# EasyEDA Pro project ProProject_Sheet1_2025-12-18.epro

# Schematic Sheet1
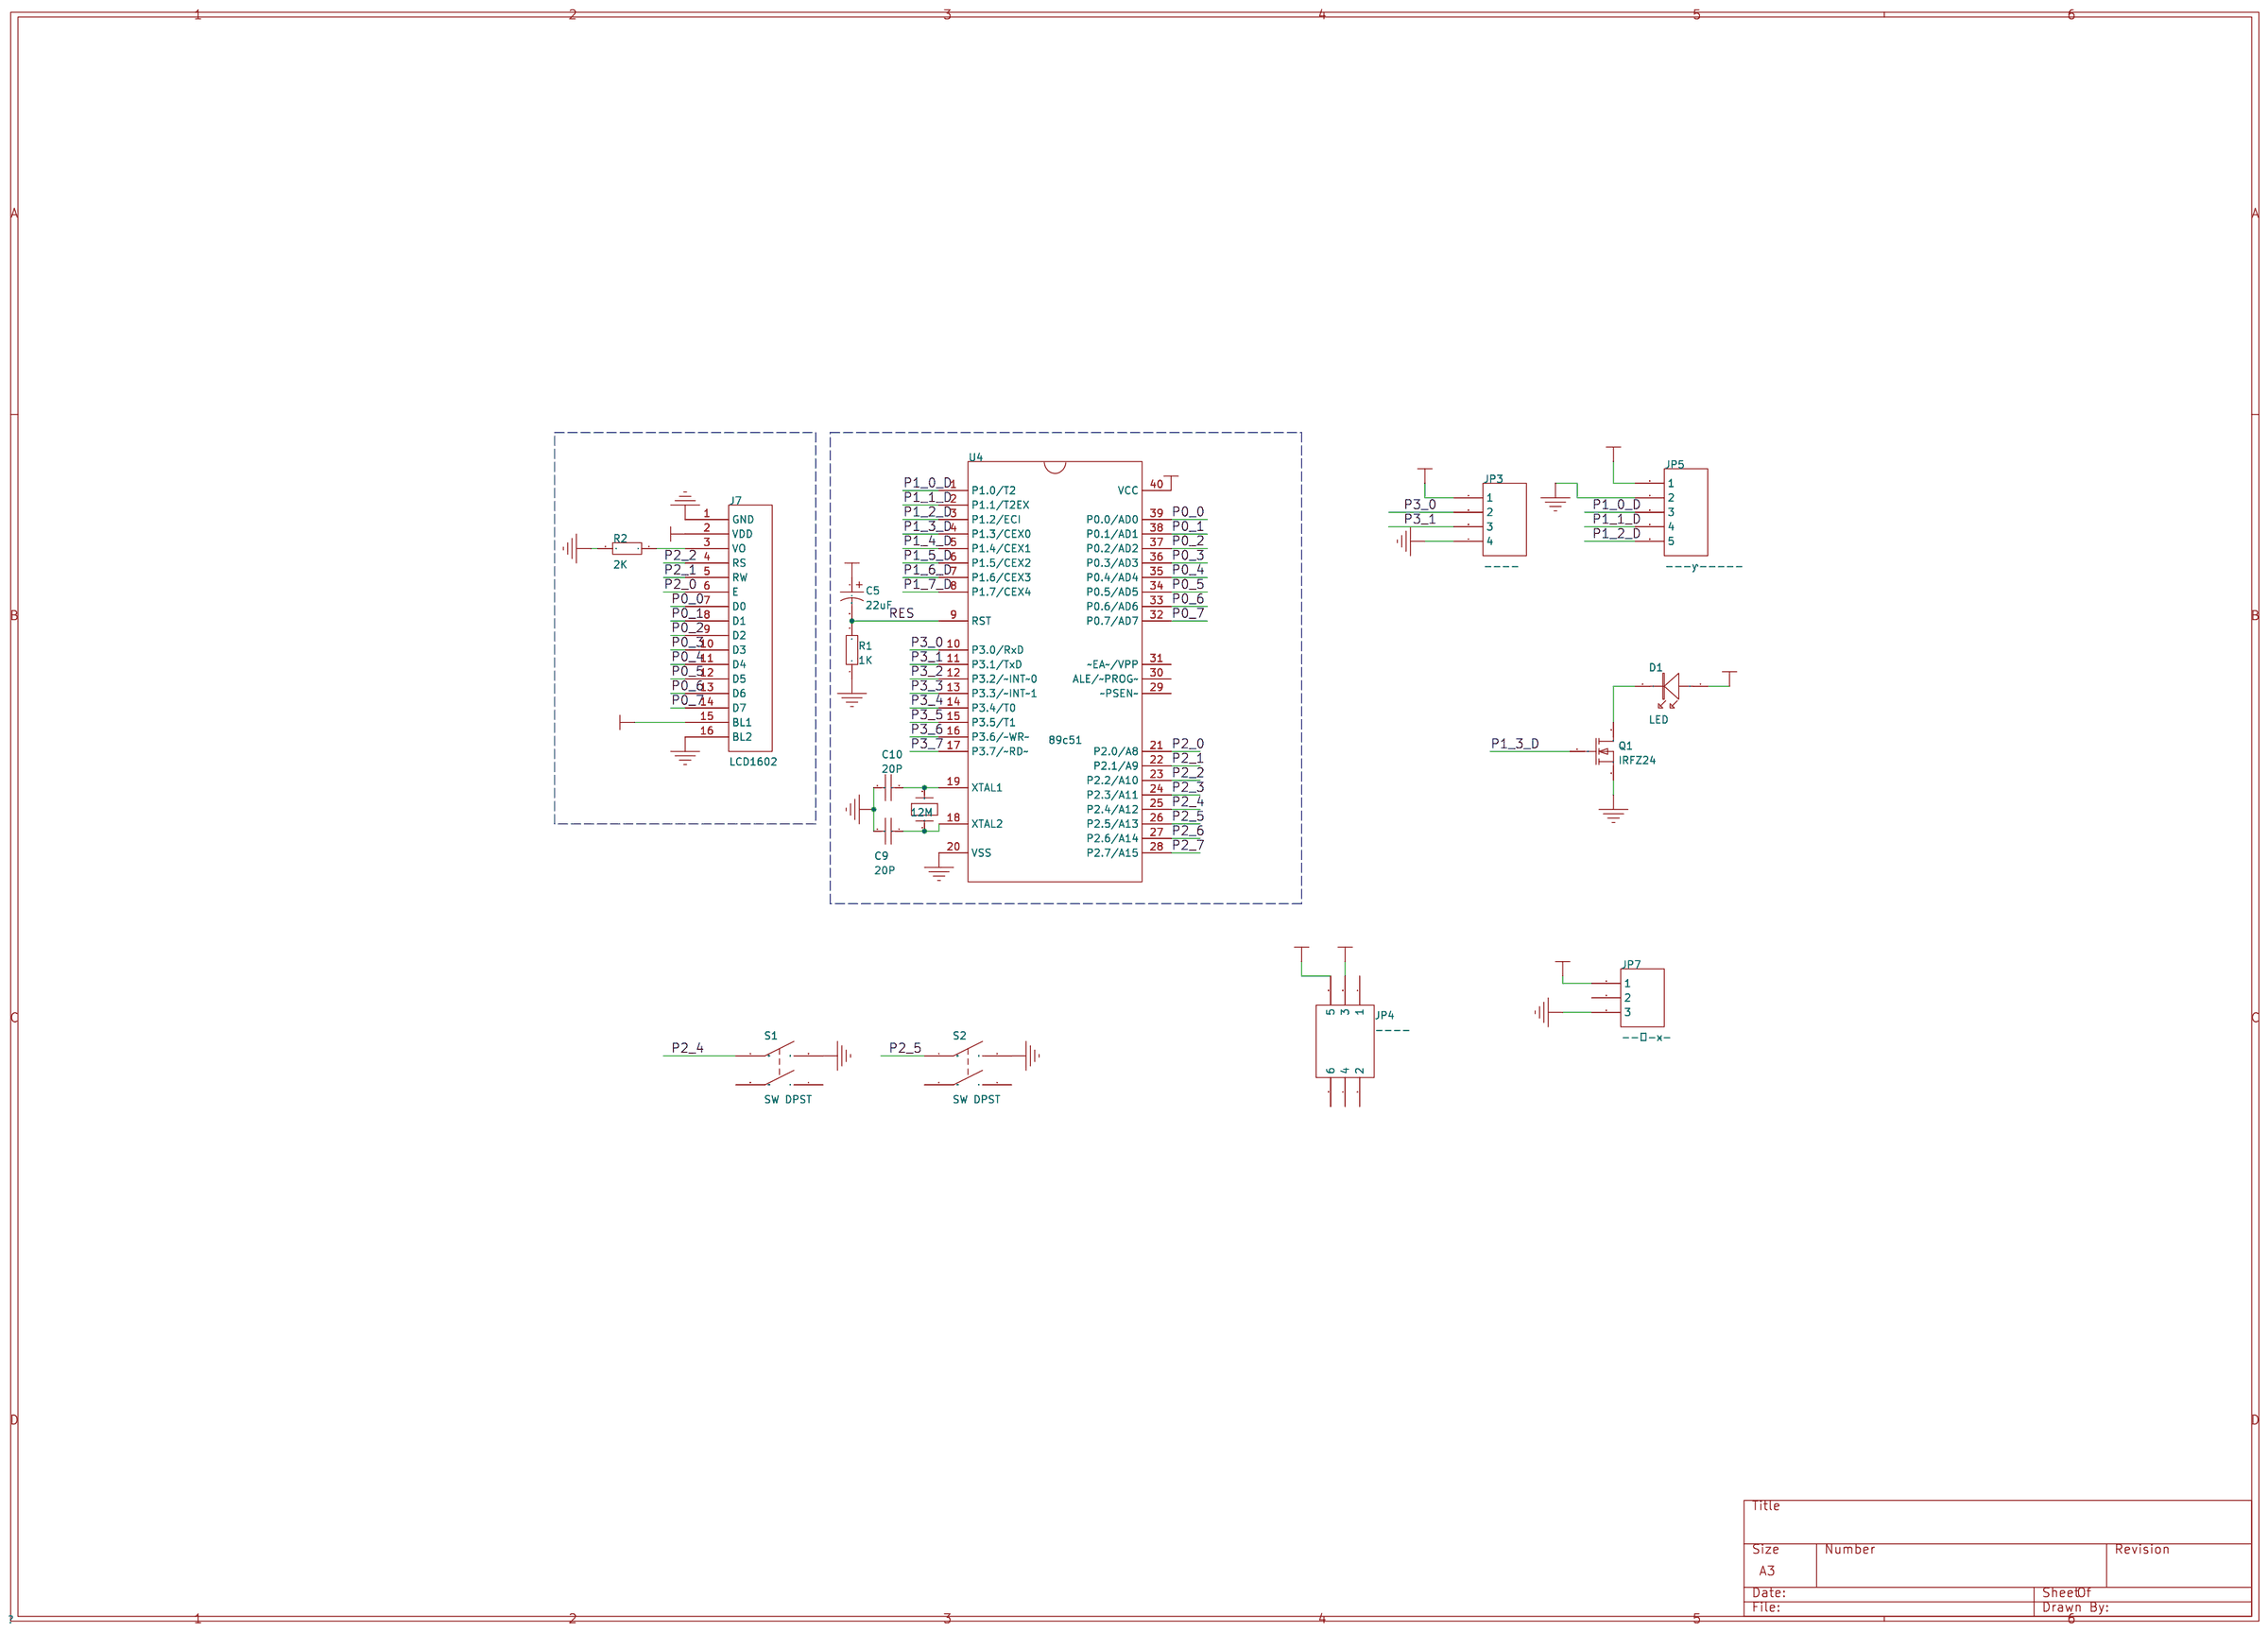
[diagram p0: schematic sheet]

## Parts
C5  22uF
C9  20P
C10  20P
D1  LED
J7  LCD1602
JP3  ----
JP4  ----
JP5  ---ƴ-----
JP7  --Դ-ӿ-
Q1  IRFZ24
R1  1K
R2  2K
S1  SW DPST
S2  SW DPST
U4  89c51
Y4  12M

## Library data of the parts
C5 = Cap Pol1: Polarized Capacitor (Radial); Published: 8-Jun-2000; LatestRevisionDate: 17-Jul-2002; LatestRevisionNote: Re-released for DXP Platform.; Publisher: Altium Limited; Origin Footprint 2: CAPPR1.27-1.7x2.8; Origin Footprint 3: CAPPR1.5-4x5; Origin Footprint 4: CAPPR2-5x6.8; Origin Footprint 5: CAPPR5-5x5; Origin Footprint 6: CAPPR7.5-16x35; Origin Footprint 1: CAP-0.2; Library Name: Miscellaneous Devices
C9 C10 = 20P: Capacitor; Origin Footprint 2: CAP-P; Origin Footprint 1: CAP-DIP; Design Item ID: CAP; Library Name: *
D1 = LED: Origin Footprint 2: DIODE0.1; Origin Footprint 1: CAP-DIP; Library Name: DIODE
J7 = LCD1602: Origin Footprint 2: HDR1X16; Library Name: *
JP3 = ����: 4 Pin Header; Design Item ID: 4 HEADER; Library Name: ---
JP4 = ����: Origin Footprint 2: IDC6; Origin Footprint 1: SW3; Design Item ID: HEADER 3X2; Library Name: -ӿ-
JP5 = ���ƴ�����: Design Item ID: HEADER 5; Library Name: --Ԫ----
JP7 = ��Դ�ӿ�: Origin Footprint 2: dip3; Origin Footprint 1: DC05; Design Item ID: HEADER 3; Library Name: --Ԫ----
Q1 = IRFZ24: N-Channel MOSFET; Library Name: --ЧӦ--
R1 R2 = Res2: Resistor; Published: 8-Jun-2000; LatestRevisionDate: 17-Jul-2002; LatestRevisionNote: Re-released for DXP Platform.; Publisher: Altium Limited; Library Name: Miscellaneous Devices
S1 S2 = SW DPST: Library Name: ----
U4 = 89c51: Origin Footprint 2: dip--40; Origin Footprint 1: dip--40; Library Name: ----Ԫ--
Y4 = 12M: Crystal; Origin Footprint 2: XY-0.3; Origin Footprint 1: XTAL; Design Item ID: CRYSTAL; Library Name: *

## Nets
GND: C9.2 C10.1 J7.1(GND) J7.16(BL2) JP3.4 JP5.2 JP7.3 Q1.3(S) R1.1 R2.2 S1.2(NO1) S2.2(NO1) U4.20(VSS)
VCC: C5.1 D1.1 J7.2(VDD) J7.15(BL1) JP3.1 JP4.3 JP5.1 U4.40(VCC)
VIN: JP4.5 JP7.1
P0_0: J7.7(D0) U4.39(P0.0/AD0)
P0_1: J7.8(D1) U4.38(P0.1/AD1)
P0_2: J7.9(D2) U4.37(P0.2/AD2)
P0_3: J7.10(D3) U4.36(P0.3/AD3)
P0_4: J7.11(D4) U4.35(P0.4/AD4)
P0_5: J7.12(D5) U4.34(P0.5/AD5)
P0_6: J7.13(D6) U4.33(P0.6/AD6)
P0_7: J7.14(D7) U4.32(P0.7/AD7)
P1_0_D: JP5.3 U4.1(P1.0/T2)
P1_1_D: JP5.4 U4.2(P1.1/T2EX)
P1_2_D: JP5.5 U4.3(P1.2/ECI)
P1_3_D: Q1.1(G) U4.4(P1.3/CEX0)
P1_4_D: U4.5(P1.4/CEX1)
P1_5_D: U4.6(P1.5/CEX2)
P1_6_D: U4.7(P1.6/CEX3)
P1_7_D: U4.8(P1.7/CEX4)
P2_0: J7.6(E) U4.21(P2.0/A8)
P2_1: J7.5(RW) U4.22(P2.1/A9)
P2_2: J7.4(RS) U4.23(P2.2/A10)
P2_3: U4.24(P2.3/A11)
P2_4: S1.1(COMMON1) U4.25(P2.4/A12)
P2_5: S2.1(COMMON1) U4.26(P2.5/A13)
P2_6: U4.27(P2.6/A14)
P2_7: U4.28(P2.7/A15)
P3_0: JP3.2 U4.10(P3.0/RxD)
P3_1: JP3.3 U4.11(P3.1/TxD)
P3_2: U4.12(P3.2/~INT~0)
P3_3: U4.13(P3.3/~INT~1)
P3_4: U4.14(P3.4/T0)
P3_5: U4.15(P3.5/T1)
P3_6: U4.16(P3.6/~WR~)
P3_7: U4.17(P3.7/~RD~)
RES: C5.2 R1.2 U4.9(RST)
Net-(C9-1): C9.1 U4.18(XTAL2) Y4.1
Net-(C10-2): C10.2 U4.19(XTAL1) Y4.2
Net-(D1-2): D1.2 Q1.2(D)
Net-(J7-3): J7.3(VO) R2.1

Not connected (* = marked no-connect by the designer): JP4 1 2 4 6; JP7 2; S1 3(COMMON2) 4(NO2); S2 3(COMMON2) 4(NO2); U4 29(~PSEN~) 30(ALE/~PROG~) 31(~EA~/VPP)

# Board PCB1_1
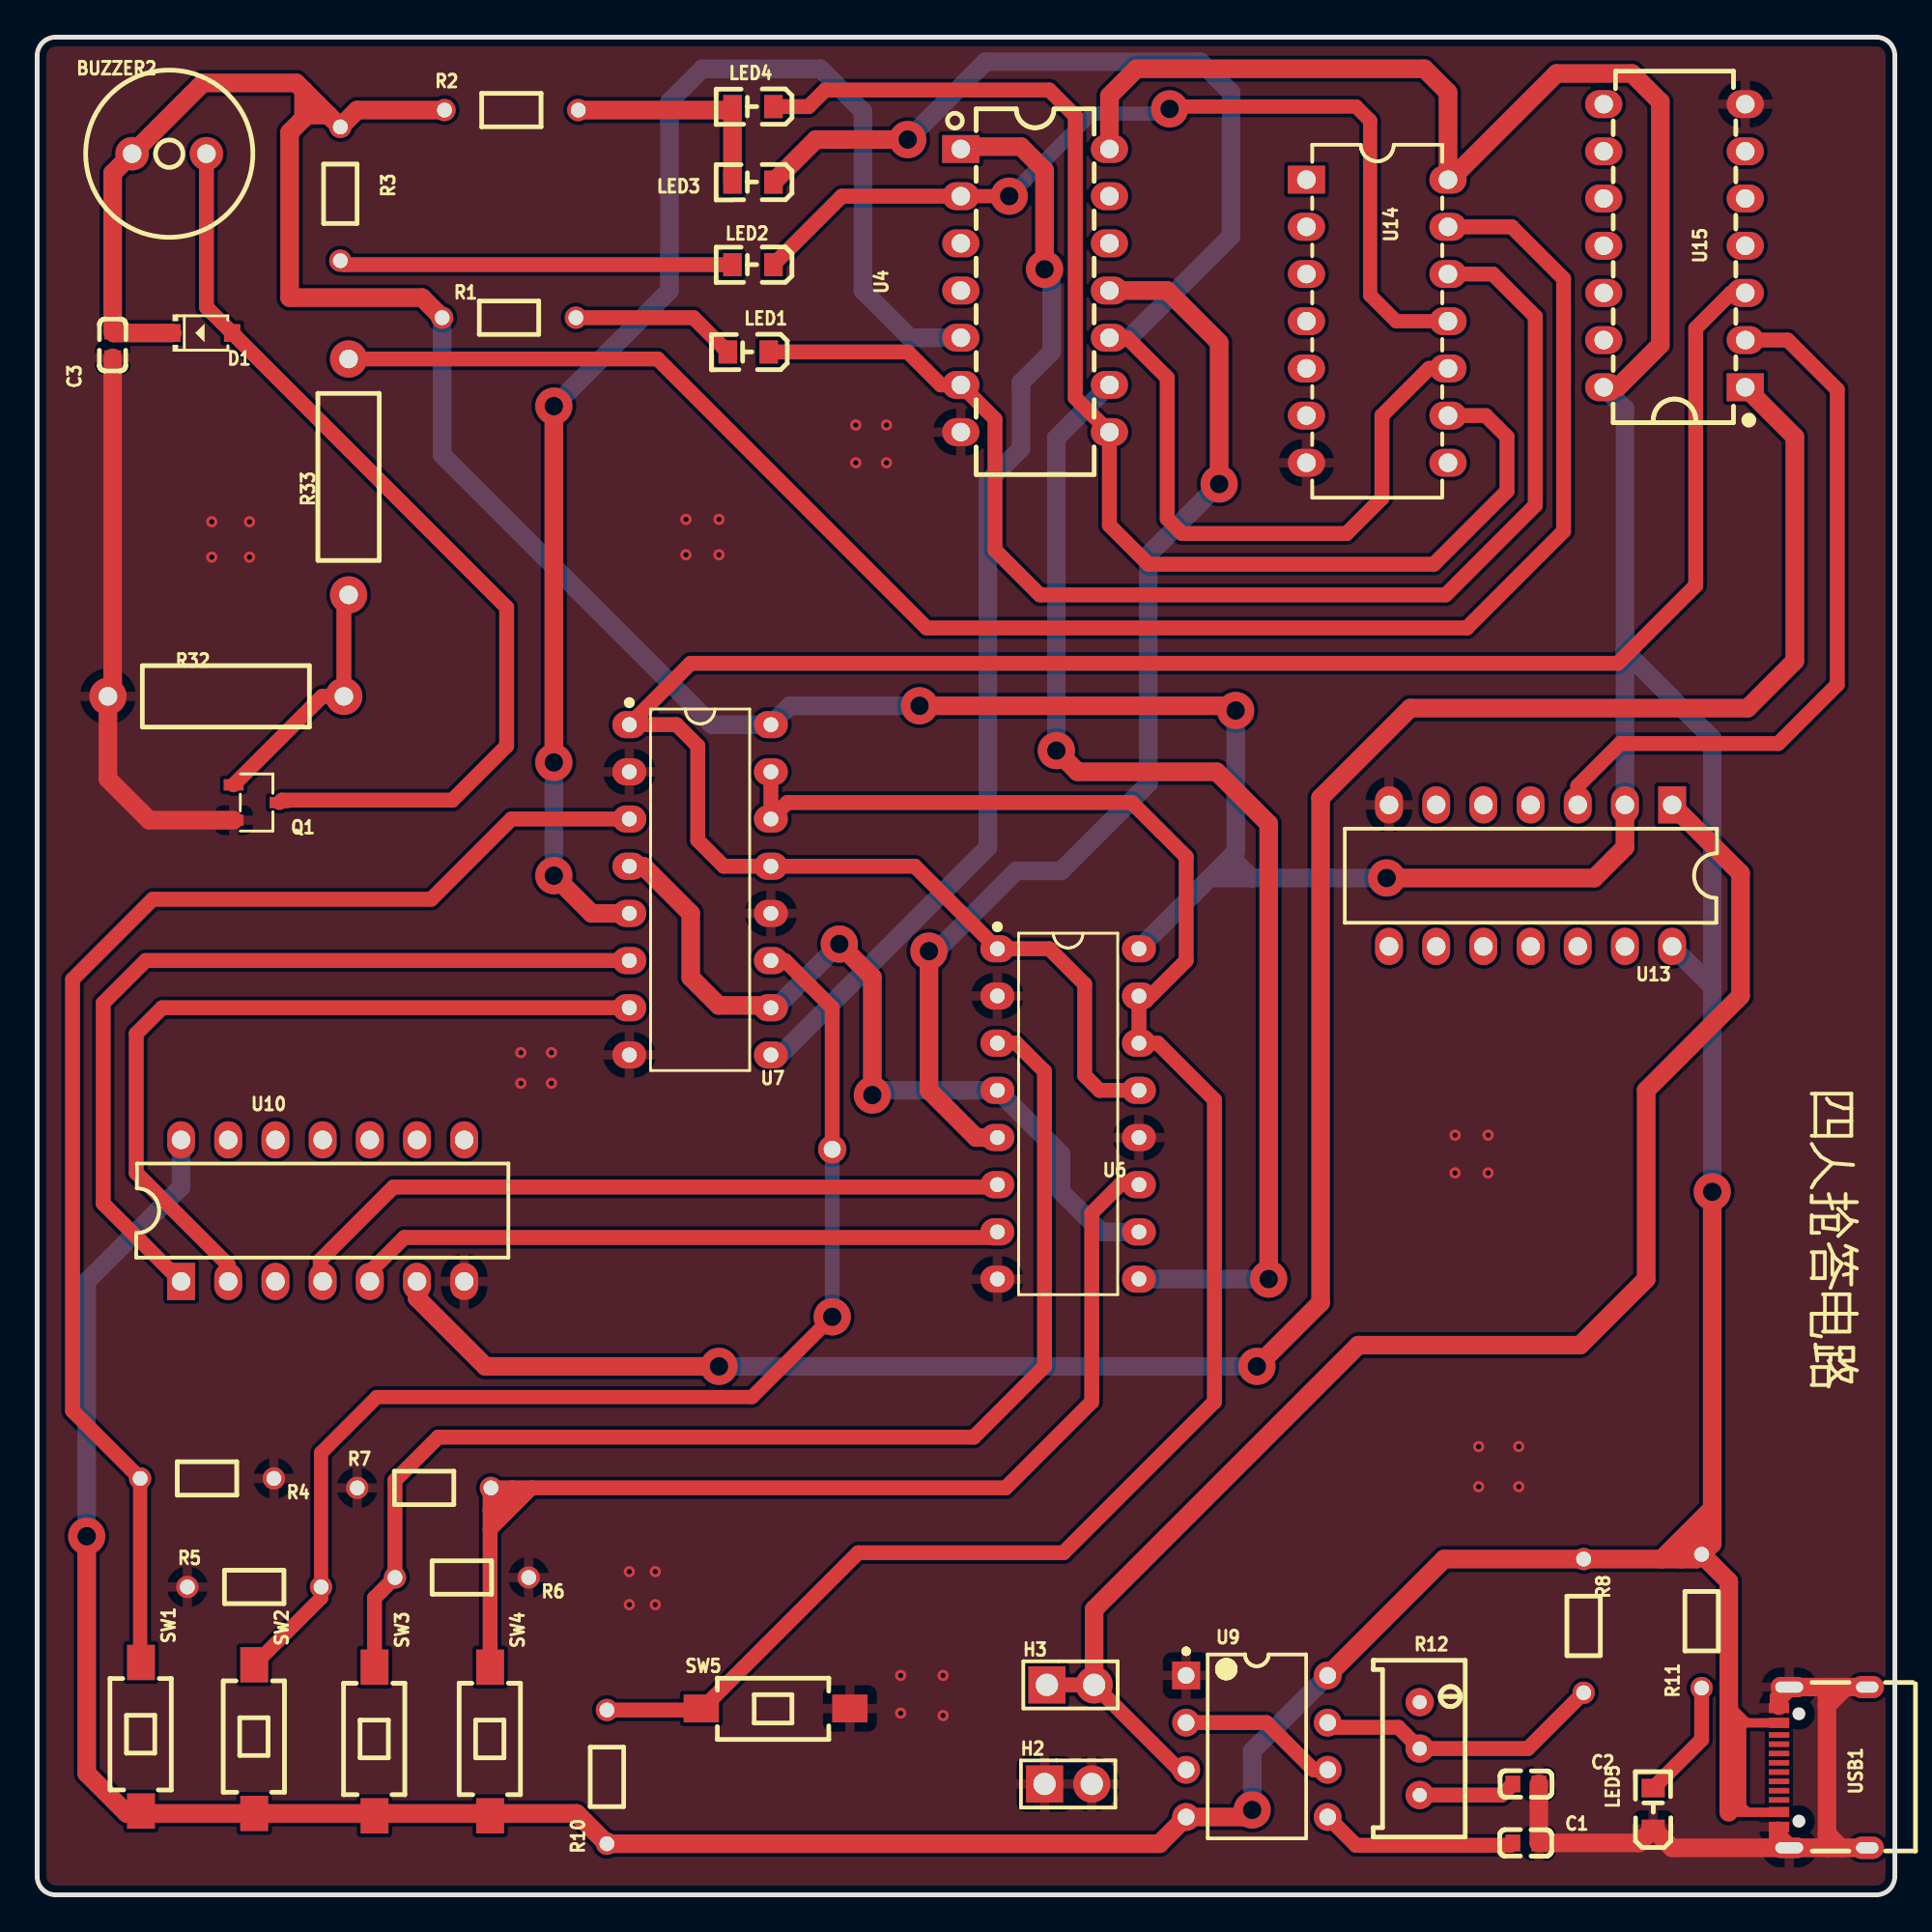
[diagram p1: board, top side]
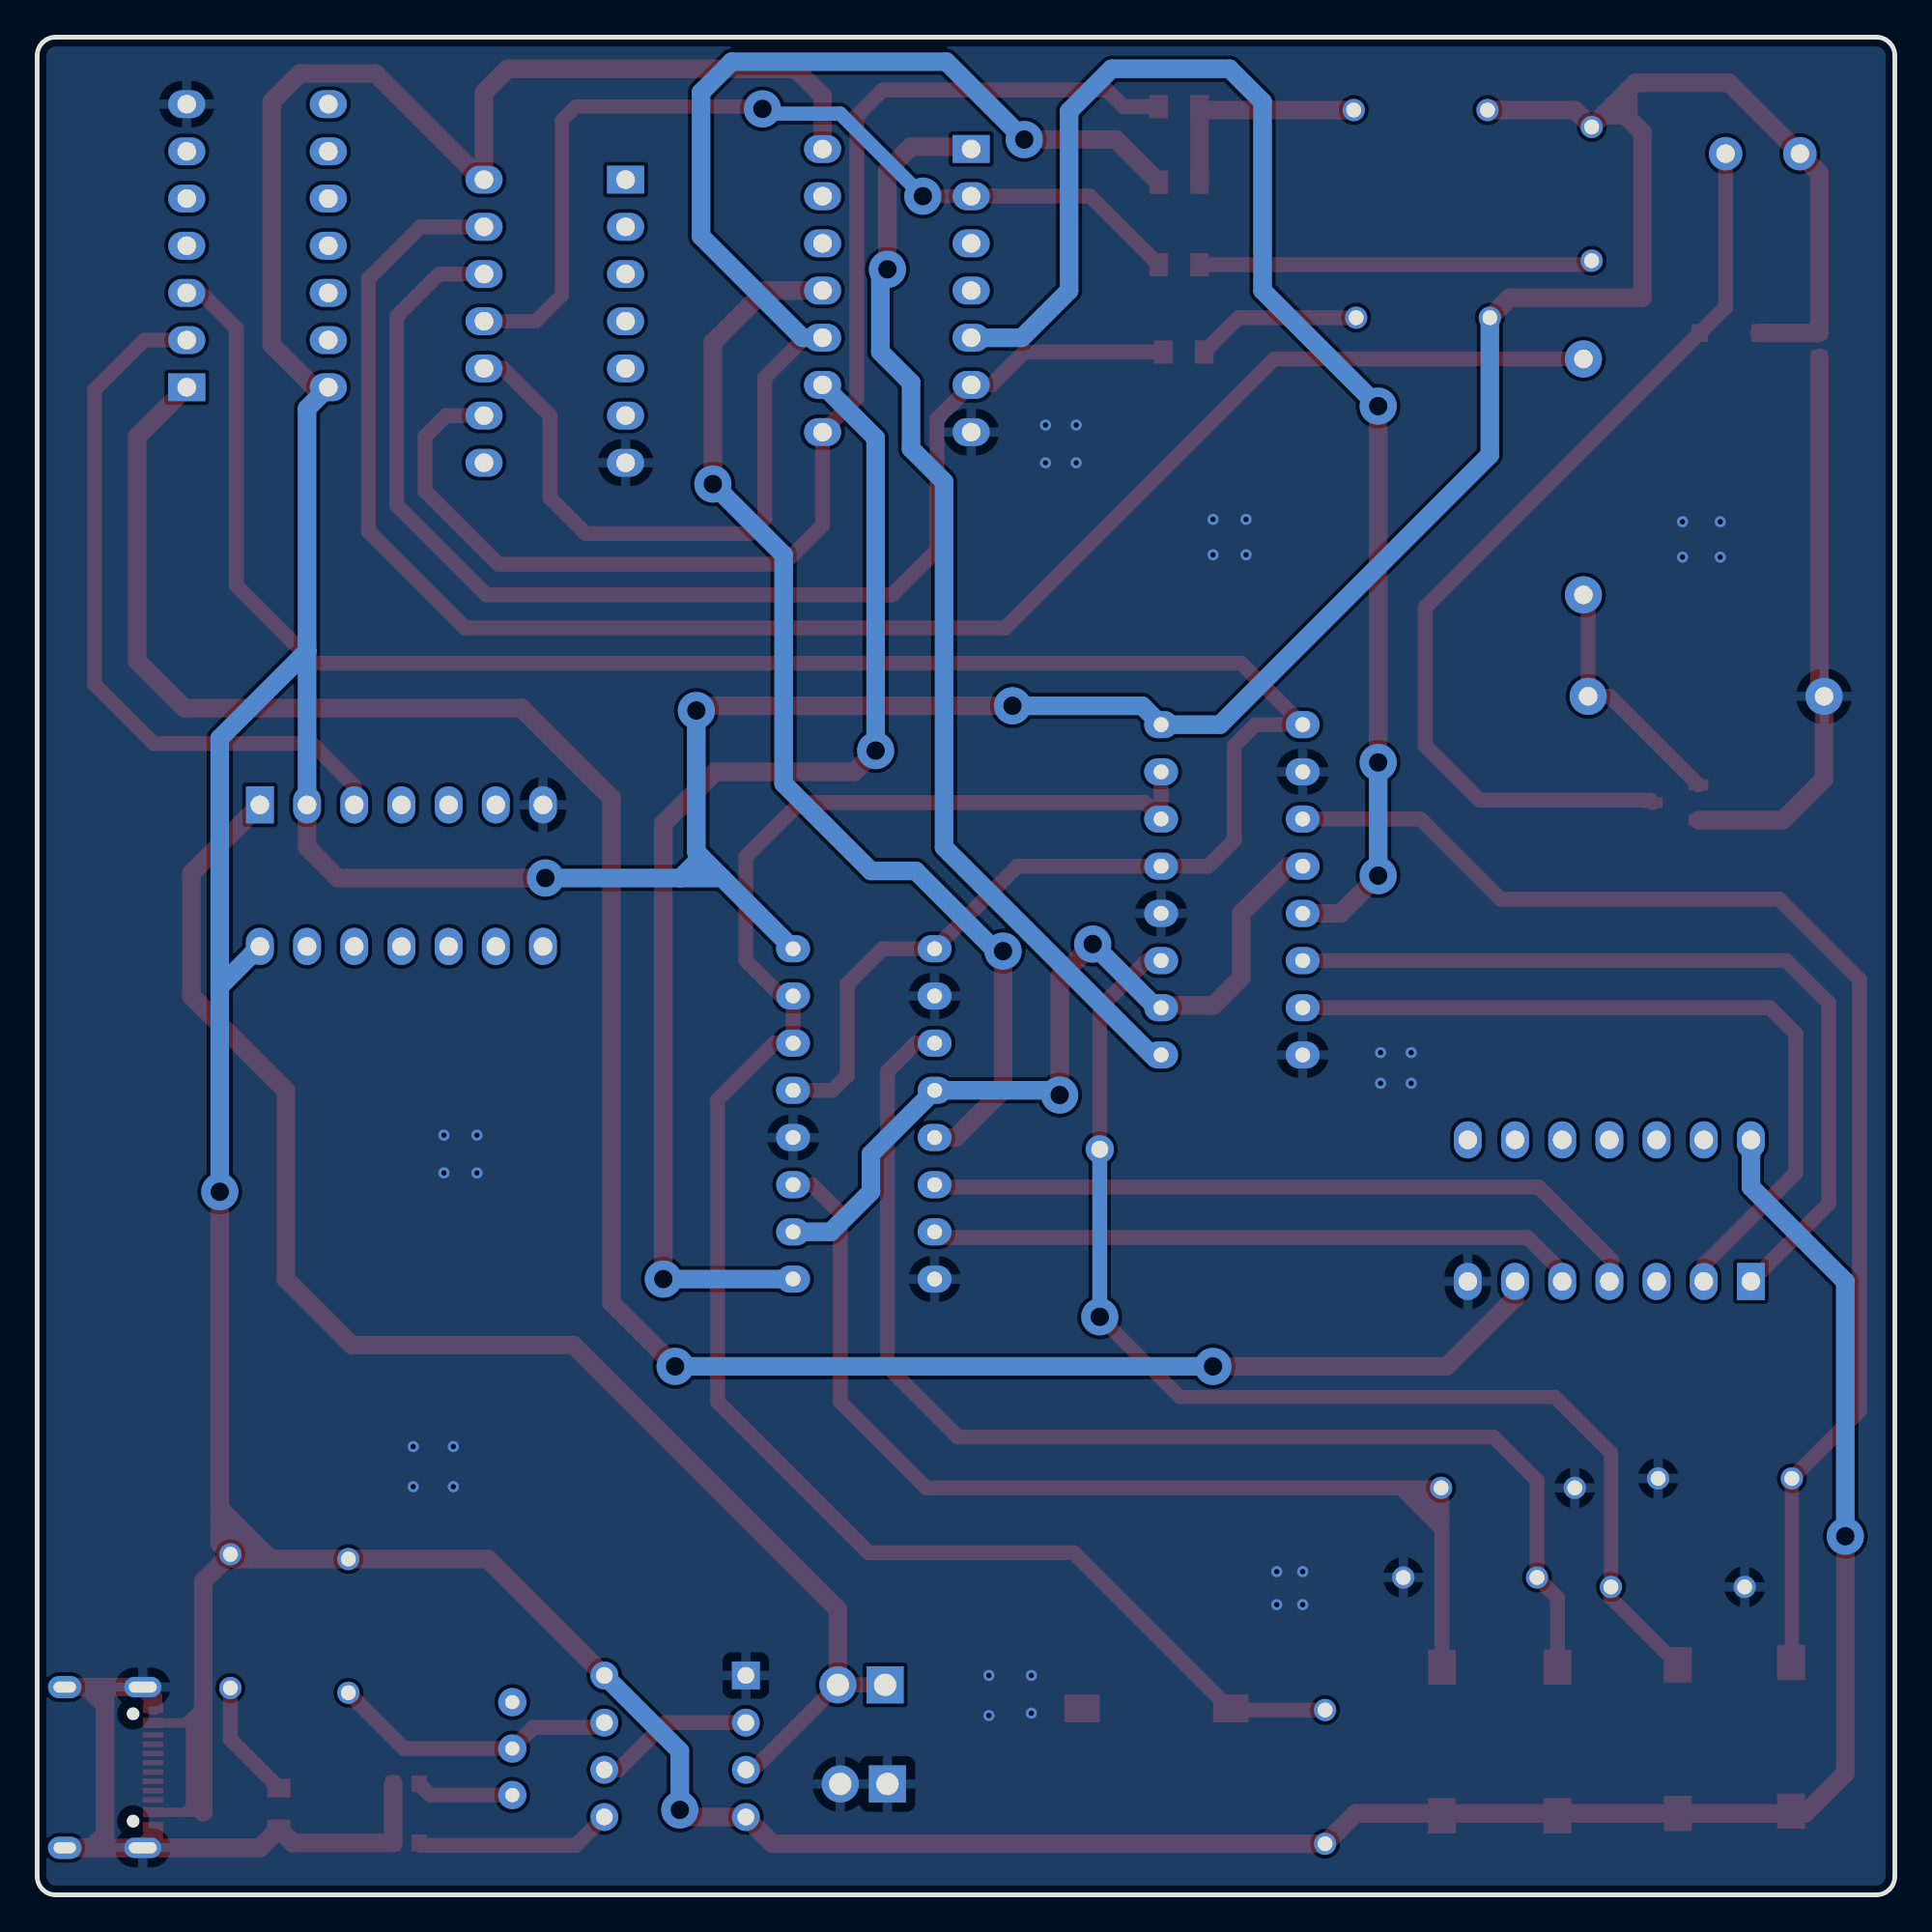
[diagram p2: board, bottom side, seen from below]

Outline 100 x 100 mm; copper layers: Top Layer, Bottom Layer. Coordinates in mm from the lower left corner of the outline.
Outline path: 0,99 0,1 arc(0.29,0.29) 1,0 99,0 arc(99.71,0.29) 100,1 100,99 arc(99.71,99.71) 99,100 1,100 arc(0.29,99.71) 0,99
Stack: Top Layer 0.035mm / Dielectric1 1.51mm FR4 er 4.5 / Bottom Layer 0.035mm

## Design rules (mm)
template: JLCPCB Capability(Two Layers Board)
spacing copperThickness1oz (default): track to track 0.102, other pairs 0.152 to 0.3
spacing copperThickness2oz: track to track 0.203, other pairs 0.152 to 0.3
track width copperThickness1oz (default): min 0.127, default 0.254, max 2.54
track width copperThickness2oz: min 0.203, default 0.254, max 2.54
differential pair differentialPair (default): width min 0.127, default 0.254, max 2.54; gap min 0.152, default 0.152
via viaSize (default): diameter min 0.5, default 0.61, max 10; hole min 0.3, default 0.305, max 6.3

## Placement (name value [footprint] x y rotation side)
BUZZER2  2.7kHz  [BUZ-TH_BD9.0-P4.00-D0.6-FD]  7.11 93.73 0 top
C1  0.1uf  [C0603]  80.14 2.79 0 top
C2  0.01uf  [C0603]  80.14 5.97 180 top
C3  0.1uF  [C0603]  4.06 83.44 90 top
D1  1N4148W  [SOD-123_L2.7-W1.6-LS3.7-FD]  8.89 84.07 180 top
H2  PZ254V-11-02P  [HDR-TH_2P-P2.54-V-M]  55.5 5.97 0 top
H3  PZ254V-11-02P  [HDR-TH_2P-P2.54-V-M]  55.63 11.3 0 top
LED1  -  [LED_0805]  38.23 83.06 180 top
LED2  -  [LED_0805]  38.48 87.76 180 top
LED3  -  [LED_0805]  38.48 92.2 180 top
LED4  -  [LED_0805]  38.48 96.27 180 top
LED5  -  [LED_0805]  87 4.7 90 top
NOREF  -  [Pad_e84]  42.8 40.13 0 top
Q1  S8050  [SOT-23-3_L2.9-W1.6-P1.90-LS2.8-BR]  11.81 58.8 180 top
R1  450Ω  [Res_1/8W]  25.4 84.84 0 top
R2  450  [Res_1/8W]  25.53 96.01 0 top
R3  450  [Res_1/8W]  16.38 91.57 90 top
R4  330  [Res_1/8W]  9.14 22.48 180 top
R5  330  [Res_1/8W]  11.68 16.51 0 top
R6  330  [Res_1/8W]  22.86 17.15 180 top
R7  330  [Res_1/8W]  20.83 21.84 0 top
R8  360  [Res_1/8W]  83.19 14.48 270 top
R10  47kΩ  [Res_1/8W]  30.73 6.35 90 top
R11  1K  [Res_1/8W]  89.66 14.73 90 top
R12  1kΩ（720）  [RES-ADJ-TH_3P-L10.0-W10.0-P2.50-BL-BS]  74.42 7.87 0 top
R32  10kΩ  [R_AXIAL-0.5/2W]  10.16 64.52 0 top
R33  1kΩ  [R_AXIAL-0.5/2W]  16.76 76.33 90 top
SW1  TS-1101-C-W  [SW-SMD_L6.0-W3.3-LS8.0]  5.59 8.51 270 top
SW2  TS-1101-C-W  [SW-SMD_L6.0-W3.3-LS8.0]  11.68 8.38 270 top
SW3  TS-1101-C-W  [SW-SMD_L6.0-W3.3-LS8.0]  18.16 8.25 270 top
SW4  TS-1101-C-W  [SW-SMD_L6.0-W3.3-LS8.0]  24.38 8.25 270 top
SW5  TS-1101-C-W  [SW-SMD_L6.0-W3.3-LS8.0]  39.75 10.03 0 top
U4  反相器  [PDIP-14_L19.7-W6.6-P2.54-LS8.3-BL]  53.72 86.36 270 top
U6  JK  [DIP-16_L19.2-W6.6-P2.54-LS7.6-BL]  55.5 42.04 270 top
U7  JK  [DIP-16_L19.2-W6.6-P2.54-LS7.6-BL]  35.69 54.1 270 top
U9  NE555N  [DIP-8_L9.8-W6.6-P2.54-LS7.6-BL]  65.66 8 270 top
U10  XD74LS20  [DIP-14_L20.0-W7.6-P2.54-LS7.6-BL]  15.37 36.83 0 top
U13  XD74LS00  [DIP-14_L20.0-W7.6-P2.54-LS7.6-BL]  80.39 54.86 180 top
U14  CD4072BE  [DIP-14_L19.0-W7.0-P2.54-LS7.6-BL]  72.14 84.71 270 top
U15  XD74LS32  [DIP-14_L18.9-W6.4-P2.54-LS7.6-BL]  88.14 88.77 90 top
USB1  TYPE-C 16PIN 2MD(073)  [USB-C-SMD_TYPE-C-6PIN-2MD-073]  96.14 6.86 90 top

## Footprints (pads in the part's own frame, mm; a bottom-side part is the same pattern mirrored in y, then rotated)
BUZ-TH_BD9.0-P4.00-D0.6-FD
  round 1.8 hole 1: 1(-2,0) 2(2,0)
C0603
  rect 0.8x0.9 smd: 1(-0.7,0) 2(0.7,0)
DIP-8_L9.8-W6.6-P2.54-LS7.6-BL
  rect 1.5x1.5 hole 0.9: 1(-3.81,-3.81)
  round 1.5 hole 0.9: 2(-1.27,-3.81) 3(1.27,-3.81) 4(3.81,-3.81) 5(3.81,3.81) 6(1.27,3.81) 7(-1.27,3.81) 8(-3.81,3.81)
DIP-14_L18.9-W6.4-P2.54-LS7.6-BL
  rect 1.5x2 hole 1: 1(-7.62,-3.81)
  oval 1.5x2 hole 1: 2(-5.08,-3.81) 3(-2.54,-3.81) 4(0,-3.81) 5(2.54,-3.81) 6(5.08,-3.81) 7(7.62,-3.81) 8(7.62,3.81) 9(5.08,3.81) 10(2.54,3.81) 11(0,3.81) 12(-2.54,3.81) 13(-5.08,3.81) 14(-7.62,3.81)
DIP-14_L19.0-W7.0-P2.54-LS7.6-BL
  rect 1.5x2 hole 1: 1(-7.62,-3.81)
  oval 1.5x2 hole 1: 2(-5.08,-3.81) 3(-2.54,-3.81) 4(0,-3.81) 5(2.54,-3.81) 6(5.08,-3.81) 7(7.62,-3.81) 8(7.62,3.81) 9(5.08,3.81) 10(2.54,3.81) 11(0,3.81) 12(-2.54,3.81) 13(-5.08,3.81) 14(-7.62,3.81)
DIP-14_L20.0-W7.6-P2.54-LS7.6-BL
  rect 1.5x2 hole 1: 1(-7.62,-3.81)
  oval 1.5x2 hole 1: 2(-5.08,-3.81) 3(-2.54,-3.81) 4(0,-3.81) 5(2.54,-3.81) 6(5.08,-3.81) 7(7.62,-3.81) 8(7.62,3.81) 9(5.08,3.81) 10(2.54,3.81) 11(0,3.81) 12(-2.54,3.81) 13(-5.08,3.81) 14(-7.62,3.81)
DIP-16_L19.2-W6.6-P2.54-LS7.6-BL
  oval 1.46x1.825 hole 0.8: 1(-8.89,-3.81) 2(-6.35,-3.81) 3(-3.81,-3.81) 4(-1.27,-3.81) 5(1.27,-3.81) 6(3.81,-3.81) 7(6.35,-3.81) 8(8.89,-3.81) 9(8.89,3.81) 10(6.35,3.81) 11(3.81,3.81) 12(1.27,3.81) 13(-1.27,3.81) 14(-3.81,3.81) 15(-6.35,3.81) 16(-8.89,3.81)
HDR-TH_2P-P2.54-V-M
  rect 2x2 hole 1.2: 1(-1.27,0)
  round 2 hole 1.2: 2(1.27,0)
LED_0805
  rect 1x1.25 smd: 1(-1.15,0.005) 2(1.05,0.005)
Pad_e84
  round 1.524 hole 0.914: 17(0,0)
PDIP-14_L19.7-W6.6-P2.54-LS8.3-BL
  rect 1.5x2 hole 1: 1(-7.62,-4)
  oval 1.5x2 hole 1: 2(-5.08,-4) 3(-2.54,-4) 4(0,-4) 5(2.54,-4) 6(5.08,-4) 7(7.62,-4) 8(7.62,4) 9(5.08,4) 10(2.54,4) 11(0,4) 12(-2.54,4) 13(-5.08,4) 14(-7.62,4)
R_AXIAL-0.5/2W
  round 2 hole 1: 1(-6.35,0) 2(6.35,0)
RES-ADJ-TH_3P-L10.0-W10.0-P2.50-BL-BS
  round 1.524 hole 0.762: 1(0,2.5) 2(0,0) 3(0,-2.5)
Res_1/8W
  round 1.199 hole 0.8: 1(-3.599,0.063) 2(3.599,0.063)
SOD-123_L2.7-W1.6-LS3.7-FD
  rect 0.88x0.96 smd: 1(-1.61,0) 2(1.61,0)
SOT-23-3_L2.9-W1.6-P1.90-LS2.8-BR
  rect 1.07x0.6 smd: 1(1.235,-0.95) 2(1.235,0.95) 3(-1.235,0)
SW-SMD_L6.0-W3.3-LS8.0
  rect 1.9x1.5 smd: 1(-4,0) 2(4,0)
USB-C-SMD_TYPE-C-6PIN-2MD-073
  rect 0.55x1.1 smd: 1(-3.2,2.375) 2(-2.4,2.375) 11(2.4,2.375) 12(3.2,2.375)
  rect 0.3x1.1 smd: 3(-1.75,2.375) 4(-1.25,2.375) 5(-0.75,2.375) 6(-0.25,2.375) 7(0.25,2.375) 8(0.75,2.375) 9(1.25,2.375) 10(1.75,2.375)
  oval 1.1x2 hole 0.6x1.5: 13(-4.325,1.825) 14(4.325,1.825)
  oval 1.2x1.8 hole 0.6x1.2: 13(-4.325,-2.375) 14(4.325,-2.375)

## Nets
5V: U6.4 U6.10 U7.4 U7.10
+5V: BUZZER2.1 C3.2 D1.2 R1.1 R2.1 R3.2 R8.1 R10.1 R11.2 SW1.2 SW2.2 SW3.2 SW4.2 U4.14 U6.16 U7.16 U9.4 U9.8 U10.14 U13.2 U13.14 U14.14 U15.14 USB1.2 USB1.11
GND: C1.2 C2.1 C3.1 H2.1 H2.2 LED5.1 Q1.2 R4.1 R5.1 R6.1 R7.1 R32.1 SW5.2 U4.7 U6.2 U6.8 U6.12 U7.2 U7.8 U7.12 U9.1 U10.7 U13.7 U14.7 U15.7 USB1.1 USB1.12 USB1.13 USB1.14
1A: U4.1 U7.9
1J: R4.2 SW1.1 U7.3
1Y: U10.6 U15.1
2J: NOREF.17 R5.2 SW2.1 U7.11
2Y: U13.3 U15.2
3A: U4.5 U7.5
3J: R6.2 SW3.1 U6.3
4A: U4.9 U6.9
4J: R7.2 SW4.1 U6.11
5A: U4.11 U6.5
CLR': R10.2 SW5.1 U6.14 U6.15 U7.14 U7.15
DISCH: R8.2 R12.2 U9.7
K: R33.2 U14.13
OUT: H3.1 H3.2 U9.3 U13.1
Q1: U7.6 U10.1
Q2: U7.7 U10.2
Q3: U6.6 U10.4
Q4: U6.7 U10.5
TRIG: U9.2 U9.6
Y: U6.1 U6.13 U7.1 U7.13 U15.3
$1N5617: C1.1 U9.5
$1N5704: LED5.2 R11.1
$1N5843: C2.2 R12.3
$1N5915: LED1.2 R1.2
$1N5919: LED2.2 R3.1
$1N5928: LED3.2 LED4.2 R2.2
$1N14352: LED1.1 U4.6 U14.12
$1N14361: LED2.1 U4.2 U14.11
$1N14370: LED3.1 U4.10 U14.10
$1N14379: LED4.1 U4.8 U14.9
$1N15698: Q1.1 R32.2 R33.1
$1N15700: BUZZER2.2 D1.1 Q1.3

Pads without a net: R12 1; U4 3 4 12 13; U10 3 8 9 10 11 12 13; U13 4 5 6 8 9 10 11 12 13; U14 1 2 3 4 5 6 8; U15 4 5 6 8 9 10 11 12 13; USB1 3 4 5 6 7 8 9 10

## Via types
v1: diameter 2, hole 1, Top Layer to Bottom Layer, 22 vias
v2: diameter 0.6, hole 0.3, Top Layer to Bottom Layer, 32 vias

## Routing (per net, layer and track width the routed paths; a pad name or vN(x,y) marks a point on that pad's centre or on a via; arc(x,y) is an arc through that point)
5V: length 45.6
  Top Layer w1: v1(43.18,51.18) 44.96,49.4 v1(44.96,43.05) ; U7.10 39.37,47.88 36.69,47.88 35.18,49.39 35.18,52.83 32.64,55.37 U7.4
  Bottom Layer w1: v1(44.96,43.05) 45.21,43.31 U6.4 55.12,39.88 55.12,37.85 57.28,35.69 U6.10 ; v1(43.18,51.18) 39.75,47.75 U7.10
+5V: length 456.5
  Top Layer w0.5: 91.75,9.11 91.97,9.32 ; 91.75,9.11 91.75,4.76 ; 91.75,9.11 91.27,8.63 91.06,8.63 ; 91.97,9.32 91.96,9.32 ; 91.97,9.32 92.03,9.26 USB1.11 ; 91.06,4.44 92.07,4.44 ; 92.07,4.44 91.75,4.76 ; 92.07,4.44 93.75,4.44 USB1.2 ; 91.96,9.32 91.06,9.32 ; 91.96,9.32 91.06,10.22 ; 91.75,4.76 91.24,5.27 91.06,5.27
  Top Layer w1: R1.1 20.72,85.98 13.59,85.98 13.59,94.88 14.35,95.63 ; 15.1,96.39 14.52,95.81 ; 15.1,96.39 14.35,97.14 ; 15.1,96.39 15.68,95.81 ; 14.52,95.81 14.35,95.63 ; 14.52,95.81 15.68,95.81 ; v1(47.5,64.01) 64.26,64.01 v1(64.52,63.75) ; 88.5,18.08 87.45,18.08 ; 88.5,18.08 90.17,19.75 ; 88.5,18.08 89.34,18.08 R11.2 ; 87.45,18.08 R8.1 75.74,18.08 U9.8 ; 87.45,18.08 90.17,20.8 ; 14.35,97.14 13.95,97.54 8.92,97.54 BUZZER2.1 4.06,92.68 C3.2 4.13,84.07 D1.2 ; 14.35,97.14 14.35,95.63 ; U4.14 57.72,96.84 59.18,98.3 74.68,98.3 75.95,97.03 75.95,92.33 76.07,92.33 81.79,98.04 85.85,98.04 87.38,96.52 87.38,83.44 85.09,81.15 U15.14 ; v1(2.67,19.3) 2.67,6.54 4.83,4.38 SW2.2 29.04,4.38 30.67,2.75 60.41,2.75 U9.4 65.02,4.19 v1(65.41,4.57) ; R2.1 17.23,96.08 R3.2 15.68,95.81 ; R11.2 90.17,18.9 90.17,19.75 ; R11.2 91.06,16.87 91.06,4.44 ; 90.17,19.75 90.17,20.8 ; 90.17,20.8 v1(90.17,37.85) ; U13.2 85.47,56.39 83.82,54.74 v1(72.64,54.74)
  Bottom Layer w1: 90.17,48.89 U13.14 ; 90.17,48.89 90.17,62.26 85.47,66.96 ; 90.17,48.89 v1(90.17,37.85) ; 64.24,55.86 65.37,54.74 ; 64.24,55.86 63.12,54.74 ; 64.24,55.86 64.52,56.13 v1(64.52,63.75) ; 65.37,54.74 63.12,54.74 ; 65.37,54.74 v1(72.64,54.74) ; R1.1 21.8,77.51 36.32,62.99 U7.16 40.51,64.01 v1(47.5,64.01) ; v1(65.41,4.57) 65.41,7.75 U9.8 ; 63.12,54.74 U6.16 ; U15.14 85.47,80.01 85.47,66.96 ; U10.14 7.75,38.1 2.67,33.02 v1(2.67,19.3) ; U13.2 85.47,66.96
GND: length 69.7
  Top Layer w1: Q1.2 6.03,57.85 3.81,60.07 R32.1 4.06,64.77 4.06,82.74 ; 94.31,2.53 93.73,3.12 93.73,3.45 ; 94.31,2.53 88.01,2.53 LED5.1 86.24,2.79 C1.2 C2.1 ; 94.31,2.53 96.37,2.53 ; 96.35,11.18 97.33,11.18 ; 96.35,11.18 96.35,10.2 ; 96.35,11.18 USB1.14 93.76,10.63 93.76,10.19 ; 97.33,11.18 96.35,10.2 ; 97.33,11.18 USB1.14 ; 96.37,2.53 97.09,2.53 ; 96.37,2.53 96.35,2.56 96.35,3.27 ; 97.09,2.53 96.35,3.27 ; 97.09,2.53 98.51,2.53 ; 96.35,10.2 96.35,3.27
  vias: v2(9.4,73.91) v2(9.4,72.01) v2(11.43,73.91) v2(11.43,72.01) v2(26.03,45.34) v2(26.03,43.69) v2(27.69,45.34) v2(27.69,43.69) v2(31.88,17.4) v2(31.88,15.62) v2(33.27,17.4) v2(33.27,15.62) v2(34.93,74.04) v2(34.93,72.14) v2(36.7,74.04) v2(36.7,72.14) v2(44.07,79.12) v2(44.07,77.09) v2(45.72,79.12) v2(45.72,77.09) v2(46.48,11.81) v2(46.48,9.78) v2(48.77,11.81) v2(48.77,9.65) v2(76.33,40.89) v2(76.33,38.86) v2(77.6,24.13) v2(77.6,21.97) v2(78.1,40.89) v2(78.1,38.86) v2(79.76,24.13) v2(79.76,21.97)
1A: length 59.4
  Top Layer w1: U4.1 49.85,94.11 52.96,94.11 54.23,92.84 v1(54.23,87.5)
  Bottom Layer w1: U7.9 40,45.21 51.18,56.39 51.18,76.07 52.96,77.85 52.96,81.41 54.61,83.06 54.61,87.12 v1(54.23,87.5)
1J: length 71.8
  Top Layer w0.762: R4.2 5.55,12.55 SW1.1
  Top Layer w0.8: R4.2 1.91,26.06 1.91,49.28 6.22,53.59 21.21,53.59 25.53,57.91 U7.3
1Y: length 124.1
  Top Layer w1: U15.1 94.62,78.49 94.62,66.42 92.07,63.88 73.91,63.88 69.09,59.06 69.09,31.88 v1(65.66,28.45) ; v1(36.7,28.45) 24.13,28.45 20.45,32.13 U10.6
  Bottom Layer w1: v1(36.7,28.45) v1(65.66,28.45)
2J: length 64.4
  Top Layer w0.762: SW2.1 15.28,15.98 R5.2 15.28,23.79 18.29,26.8 38.48,26.8 v1(42.8,31.12)
  Top Layer w0.8: U7.11 40.26,50.29 42.8,47.75 NOREF.17
  Bottom Layer w0.8: v1(42.8,31.12) NOREF.17
2Y: length 39.2
  Top Layer w0.8: U15.2 94.23,83.69 96.9,81.03 96.9,65.15 93.73,61.98 85.22,61.98 82.93,59.69 82.93,58.67
3A: length 77.2
  Top Layer w1: v1(27.81,60.96) v1(27.81,80.14) ; v1(27.81,54.86) 29.84,52.83 U7.5
  Bottom Layer w1: v1(27.81,54.86) v1(27.81,60.96) ; v1(27.81,80.14) 34.04,86.36 34.04,96.52 35.81,98.3 42.16,98.3 44.45,96.01 44.45,86.36 46.99,83.82 U4.5
3J: length 67.1
  Top Layer w0.8: U6.3 52.71,45.85 54.23,44.32 54.23,28.45 50.42,24.64 21.59,24.64 19.26,22.31 R6.2 18.16,15.98 SW3.1
4A: length 65.4
  Top Layer w1: v1(54.86,61.59) 56.01,60.45 63.5,60.45 66.29,57.66 v1(66.29,33.15)
  Bottom Layer w1: v1(54.86,61.59) 54.86,78.42 U4.9 ; U6.9 v1(66.29,33.15)
4J: length 62.3
  Top Layer w0.8: 24.38,20.7 25.59,21.91 ; 24.38,20.7 24.38,21.95 24.3,22.03 ; 24.38,20.7 24.38,19.67 ; 25.59,21.91 26.62,21.91 ; 25.59,21.91 24.43,21.91 ; 24.38,19.67 26.62,21.91 ; 24.38,19.67 SW4.1 ; 26.62,21.91 52.13,21.91 56.77,26.54 56.77,36.7 58.29,38.23 U6.11
5A: length 60.2
  Top Layer w1: v1(63.63,75.95) 63.63,83.57 60.83,86.36 U4.11 ; U6.5 50.55,40.77 48.01,43.31 v1(48.01,50.8)
  Bottom Layer w1: v1(63.63,75.95) 59.82,72.14 59.82,59.82 55.12,55.12 52.71,55.12 48.39,50.8 v1(48.01,50.8)
CLR': length 99.1
  Top Layer w0.8: U7.15 U7.14 40.39,58.8 58.93,58.8 61.85,55.88 61.85,50.29 59.94,48.39 U6.15 U6.14 60.32,45.85 63.37,42.8 63.37,26.54 55.25,18.41 44.2,18.41 35.81,10.03 SW5.1 35.67,9.95 30.67,9.95
DISCH: length 15.6
  Top Layer w0.8: U9.7 69.72,9.02 73.28,9.02 R12.2 80.24,7.87 R8.2
K: length 94.5
  Top Layer w0.8: R33.2 33.4,82.68 47.88,68.2 76.96,68.2 82.17,73.41 82.17,87 79.38,89.79 U14.13
OUT: length 79.7
  Top Layer w0.8: U9.3 61.47,6.73 H3.2 H3.1
  Top Layer w1: U13.1 91.69,54.99 91.69,48.39 86.61,43.31 86.61,33.15 83.06,29.59 71.12,29.59 56.9,15.37 H3.2
Q1: length 46
  Top Layer w0.8: U10.1 3.56,37.21 3.56,48.01 5.84,50.29 U7.6
Q2: length 42.5
  Top Layer w0.8: U7.7 6.73,47.75 5.33,46.36 5.33,38.86 10.29,33.91 U10.2
Q3: length 39.9
  Top Layer w0.8: 15.24,32.89 15.24,34.16 19.18,38.1 51.82,38.1 52.14,38.42
Q4: length 35.6
  Top Layer w0.8: 51.94,35.69 51.64,35.39 19.76,35.39 17.78,33.4 17.78,32.89
TRIG: length 8.7
  Top Layer w0.8: U9.2 66.17,9.27 68.71,6.73 U9.6
Y: length 119.2
  Top Layer w0.8: U6.13 57.19,43.31 56.39,44.11 56.39,49.02 54.48,50.93 U6.1 47.24,55.37 U7.13 36.96,55.37 35.56,56.77 35.56,61.85 34.42,62.99 U7.1 35.18,66.29 85.09,66.29 89.28,70.48 89.28,84.33 91.19,86.23 U15.3
$1N5617: length 10.7
  Top Layer w0.8: C1.1 79.31,2.67 70.99,2.67 U9.5
$1N5704: length 6.5
  Top Layer w0.8: R11.1 89.6,8.36 86.99,5.75
$1N5843: length 5.3
  Top Layer w0.8: C2.2 78.84,5.37 R12.3
$1N5915: length 8.9
  Top Layer w0.8: 37.18,83.05 35.33,84.9 R1.2
$1N5919: length 21.2
  Top Layer w0.8: 37.43,87.75 16.54,87.75 R3.1
$1N5928: length 12.4
  Top Layer w1: R2.2 37.25,96.08 37.43,96.26 37.43,92.2
$1N14352: length 68.6
  Top Layer w0.8: 39.38,83.05 46.87,83.05 48.64,81.28 U4.6 51.56,79.44 51.56,72.39 53.97,69.98 75.82,69.98 80.65,74.8 80.65,84.96 78.36,87.25 75.95,87.25
$1N14361: length 50.1
  Top Layer w0.762: U4.2 v1(52.32,91.44) ; v1(60.96,96.14) 61.09,96.27 70.99,96.27 71.75,95.5 71.75,86.11 73.15,84.71 U14.11
  Top Layer w0.8: U4.2 43.32,91.44 LED2.1
  Bottom Layer w0.762: v1(52.32,91.44) 56.77,95.89 60.71,95.89 v1(60.96,96.14)
$1N14370: length 77.9
  Top Layer w0.8: U14.10 74.93,82.17 72.39,79.63 72.39,75.18 70.49,73.28 61.63,73.28 60.83,74.08 60.83,81.66 58.67,83.82 U4.10
  Top Layer w1: v1(46.86,94.49) 41.92,94.49 LED3.1
  Bottom Layer w1: v1(46.86,94.49) 51.05,98.68 62.61,98.68 64.26,97.03 64.26,89.28 58.8,83.82 U4.10
$1N14379: length 70.5
  Top Layer w0.8: U14.9 77.98,79.63 79.12,78.49 79.12,75.56 75.18,71.63 59.82,71.63 57.72,73.72 U4.8 55.88,80.58 55.88,95.76 54.48,97.16 42.42,97.16 41.52,96.26 LED4.1
$1N15698: length 13.5
  Top Layer w0.8: Q1.1 15.34,64.52 R32.2 16.51,69.72 R33.1
$1N15700: length 52.1
  Top Layer w0.8: BUZZER2.2 9.11,85.46 D1.1 25.27,69.3 25.27,61.85 22.35,58.93 13.17,58.93 Q1.3

## Copper pours and planes (outline as drawn; the poured copper is in the pictures)
GND on Top Layer: -1.4,102.23 103.89,102.23 103.89,-2.67 -1.4,-2.67
GND on Top Layer: 0.06,100 104.56,100 104.56,-4.9 0.06,-4.9
GND on Bottom Layer: -1.4,103.5 102.87,103.5 102.87,-3.43 -1.4,-3.43

## Text on the board
Top Silkscreen Layer: 四人抢答电路
